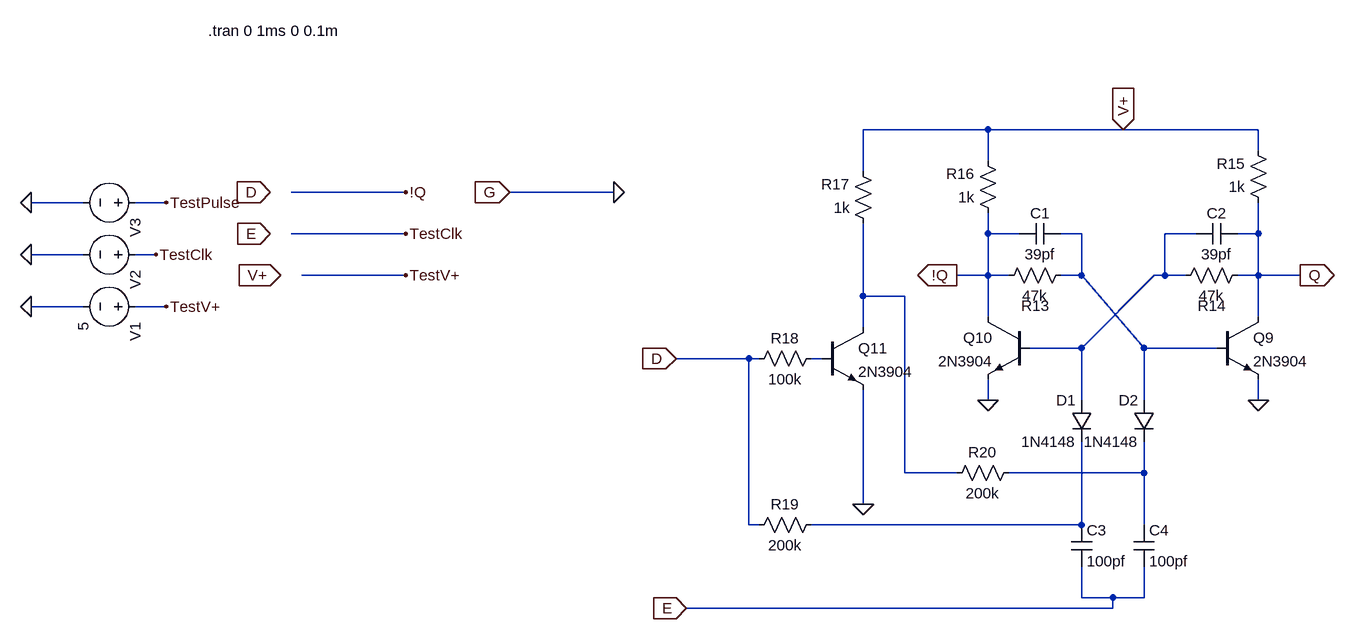
[diagram p0: schematic d-flip-flop.asc]
d-flip-flop.asc, the LTspice schematic file:
Version 4
SHEET 1 2308 2588
WIRE 928 -208 736 -208
WIRE 1136 -208 928 -208
WIRE 1344 -208 1136 -208
WIRE 1344 -176 1344 -208
WIRE 928 -160 928 -208
WIRE 736 -144 736 -208
WIRE 32 -112 -144 -112
WIRE 352 -112 192 -112
WIRE -464 -96 -544 -96
WIRE -336 -96 -384 -96
WIRE 32 -48 -144 -48
WIRE 928 -48 928 -80
WIRE 976 -48 928 -48
WIRE 1072 -48 1040 -48
WIRE 1248 -48 1200 -48
WIRE 1344 -48 1344 -96
WIRE 1344 -48 1312 -48
WIRE -464 -16 -544 -16
WIRE -352 -16 -384 -16
WIRE 32 16 -128 16
WIRE 928 16 928 -48
WIRE 928 16 880 16
WIRE 960 16 928 16
WIRE 1072 16 1072 -48
WIRE 1072 16 1040 16
WIRE 1200 16 1200 -48
WIRE 1200 16 1184 16
WIRE 1232 16 1200 16
WIRE 1344 16 1344 -48
WIRE 1344 16 1312 16
WIRE 1408 16 1344 16
WIRE 736 48 736 -64
WIRE 800 48 736 48
WIRE -464 64 -544 64
WIRE -336 64 -384 64
WIRE 928 80 928 16
WIRE 1344 80 1344 16
WIRE 736 96 736 48
WIRE 1072 128 1184 16
WIRE 1072 128 992 128
WIRE 1168 128 1072 16
WIRE 1280 128 1168 128
WIRE 560 144 448 144
WIRE 576 144 560 144
WIRE 672 144 656 144
WIRE 928 208 928 176
WIRE 1072 208 1072 128
WIRE 1168 208 1168 128
WIRE 1344 208 1344 176
WIRE 800 320 800 48
WIRE 880 320 800 320
WIRE 1168 320 1168 272
WIRE 1168 320 960 320
WIRE 736 368 736 192
WIRE 560 400 560 144
WIRE 576 400 560 400
WIRE 1072 400 1072 272
WIRE 1072 400 656 400
WIRE 1168 400 1168 320
WIRE 1072 512 1072 464
WIRE 1120 512 1072 512
WIRE 1168 512 1168 464
WIRE 1168 512 1120 512
WIRE 1120 528 1120 512
WIRE 1120 528 464 528
FLAG -544 64 0
FLAG -544 -16 0
FLAG -336 64 TestV+
FLAG -352 -16 TestClk
FLAG 464 528 E
IOPIN 464 528 In
FLAG -176 -48 E
IOPIN -176 -48 In
FLAG -160 16 V+
IOPIN -160 16 In
FLAG 32 16 TestV+
FLAG 32 -48 TestClk
FLAG 192 -112 G
IOPIN 192 -112 In
FLAG 352 -112 0
FLAG -544 -96 0
FLAG -336 -96 TestPulse
FLAG -176 -112 D
IOPIN -176 -112 In
FLAG 448 144 D
IOPIN 448 144 In
FLAG 32 -112 !Q
FLAG 1136 -208 V+
IOPIN 1136 -208 In
FLAG 928 208 0
FLAG 1344 208 0
FLAG 736 368 0
FLAG 1408 16 Q
IOPIN 1408 16 Out
FLAG 880 16 !Q
IOPIN 880 16 Out
SYMBOL voltage -368 64 R90
WINDOW 123 0 0 Left 0
WINDOW 39 0 0 Left 0
SYMATTR InstName V1
SYMATTR Value 5
SYMBOL voltage -368 -16 R90
WINDOW 3 24 96 Invisible 2
WINDOW 123 0 0 Left 0
WINDOW 39 0 0 Left 0
SYMATTR Value PULSE(0 5 0.25ms 100n 100n 25u 50u 10)
SYMATTR InstName V2
SYMBOL voltage -368 -96 R90
WINDOW 3 24 96 Invisible 2
WINDOW 123 0 0 Left 0
WINDOW 39 0 0 Left 0
SYMATTR Value PULSE(0 5 0.25ms 1n 1n 25u 50u 1)
SYMATTR InstName V3
SYMBOL npn 1280 80 R0
SYMATTR InstName Q9
SYMATTR Value 2N3904
SYMBOL npn 992 80 M0
SYMATTR InstName Q10
SYMATTR Value 2N3904
SYMBOL res 1056 0 R90
WINDOW 0 78 55 VBottom 2
WINDOW 3 32 56 VTop 2
SYMATTR InstName R13
SYMATTR Value 47k
SYMBOL res 1328 0 R90
WINDOW 0 78 55 VBottom 2
WINDOW 3 32 56 VTop 2
SYMATTR InstName R14
SYMATTR Value 47k
SYMBOL diode 1088 208 M0
SYMATTR InstName D1
SYMATTR Value 1N4148
SYMBOL diode 1184 208 M0
SYMATTR InstName D2
SYMATTR Value 1N4148
SYMBOL res 1360 -80 R180
WINDOW 0 36 76 Left 2
WINDOW 3 36 40 Left 2
SYMATTR InstName R15
SYMATTR Value 1k
SYMBOL res 944 -64 R180
WINDOW 0 36 76 Left 2
WINDOW 3 36 40 Left 2
SYMATTR InstName R16
SYMATTR Value 1k
SYMBOL cap 976 -32 R270
WINDOW 0 32 32 VTop 2
WINDOW 3 0 32 VBottom 2
SYMATTR InstName C1
SYMATTR Value 39pf
SYMBOL cap 1248 -32 R270
WINDOW 0 32 32 VTop 2
WINDOW 3 0 32 VBottom 2
SYMATTR InstName C2
SYMATTR Value 39pf
SYMBOL cap 1056 400 R0
SYMATTR InstName C3
SYMATTR Value 100pf
SYMBOL cap 1152 400 R0
SYMATTR InstName C4
SYMATTR Value 100pf
SYMBOL npn 672 96 R0
SYMATTR InstName Q11
SYMATTR Value 2N3904
SYMBOL res 752 -48 R180
WINDOW 0 36 76 Left 2
WINDOW 3 36 40 Left 2
SYMATTR InstName R17
SYMATTR Value 1k
SYMBOL res 560 160 R270
WINDOW 0 32 56 VTop 2
WINDOW 3 0 56 VBottom 2
SYMATTR InstName R18
SYMATTR Value 100k
SYMBOL res 560 416 R270
WINDOW 0 32 56 VTop 2
WINDOW 3 0 56 VBottom 2
SYMATTR InstName R19
SYMATTR Value 200k
SYMBOL res 864 336 R270
WINDOW 0 32 56 VTop 2
WINDOW 3 0 56 VBottom 2
SYMATTR InstName R20
SYMATTR Value 200k
TEXT -272 -360 Left 2 !.tran 0 1ms 0 0.1m

The netlist it stands for:
* d-flip-flop.asc
V1 TestV+ 0 5
V2 TestClk 0 PULSE(0 5 0.25ms 100n 100n 25u 50u 10)
V3 TestPulse 0 PULSE(0 5 0.25ms 1n 1n 25u 50u 1)
Q9 Q N001 0 0 2N3904
Q10 !Q N002 0 0 2N3904
R13 N001 !Q 47k
R14 Q N002 47k
D1 N002 N006 1N4148
D2 N001 N005 1N4148
R15 Q V+ 1k
R16 !Q V+ 1k
C1 !Q N001 39pf
C2 N002 Q 39pf
C3 N006 E 100pf
C4 N005 E 100pf
Q11 N003 N004 0 0 2N3904
R17 N003 V+ 1k
R18 D N004 100k
R19 D N006 200k
R20 N003 N005 200k
.model D D
.lib standard.dio
.model NPN NPN
.model PNP PNP
.lib standard.bjt
.tran 0 1ms 0 0.1m
.backanno
.end